# Altium schematic sheet CAN.SchDoc
size A4; SheetNumber: 3; SheetTotal: 7
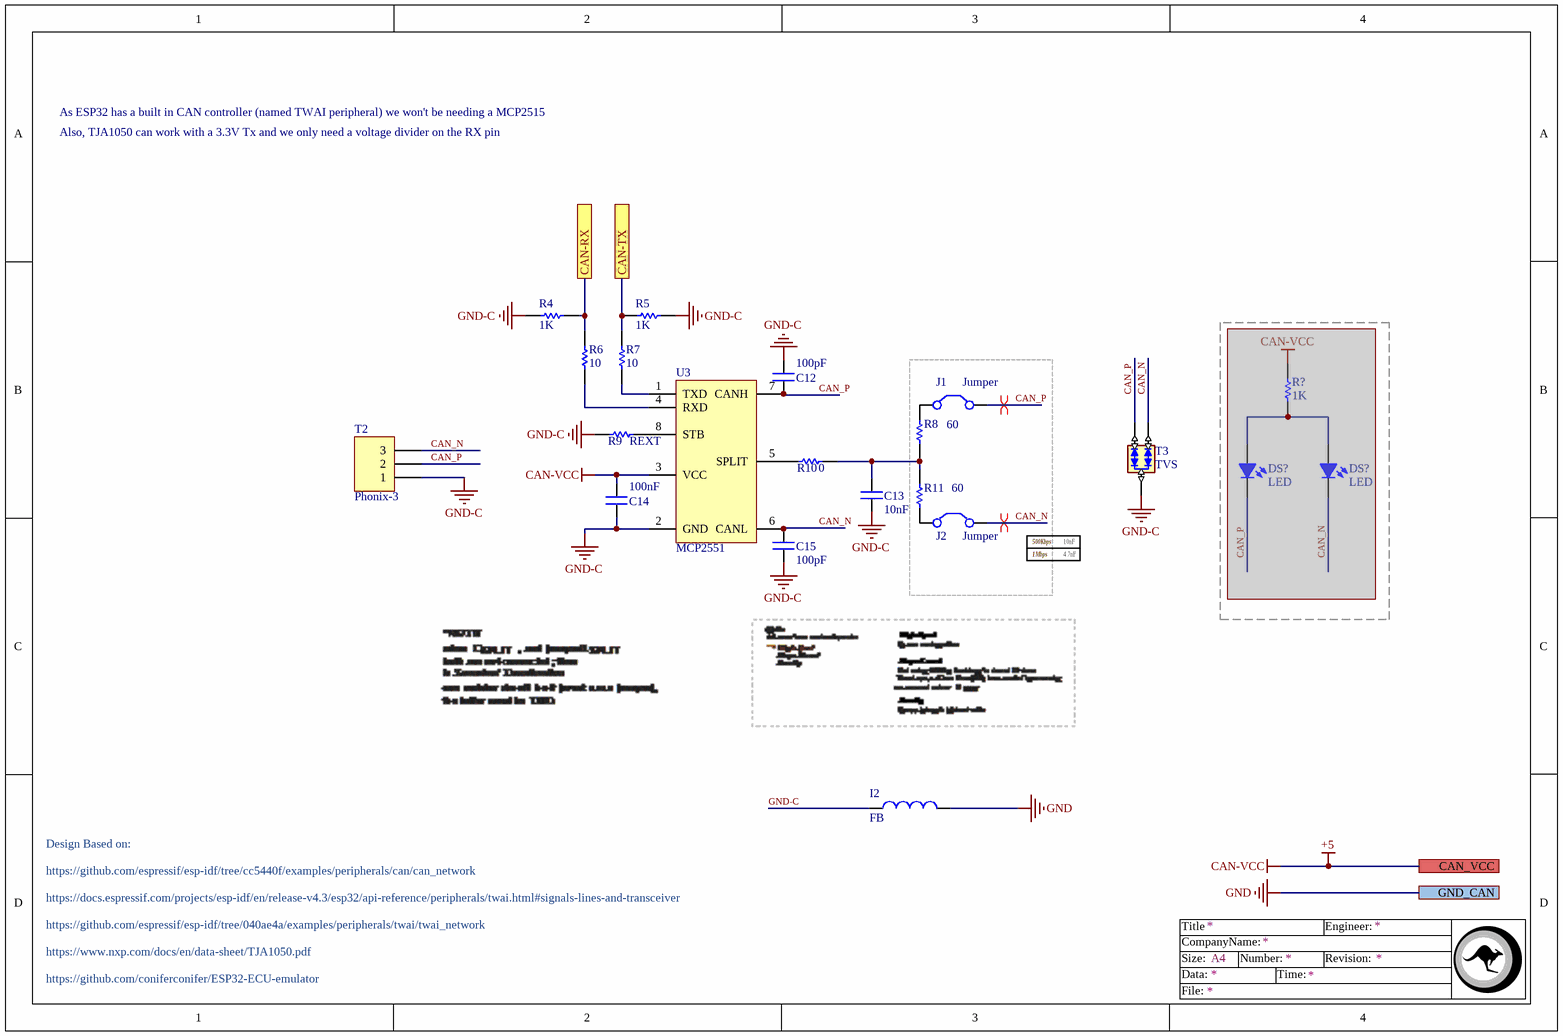
[diagram p0: CAN.SchDoc]

## Parts
(Parts that share a designator on the sheet are numbered #1, #2 ... from top to bottom, then left to right.)
C12  100pF  [Cap0805]
C13  10nF  [Cap0805]
C14  100nF  [Cap0805]
C15  100pF  [Cap0805]
DS?#1  LED  [LED_0805Green]  (masked out: inside a compile mask, not in the netlist)
DS?#2  LED  [LED_0805Green]  (masked out: inside a compile mask, not in the netlist)
I2  FB  [1206]
J1  Jumper  [Jumper Small - 2.54 - Blue]
J2  Jumper  [Jumper Small - 2.54 - Blue]
R4  1K  [R0805]
R5  1K  [R0805]
R6  10  [R0805]
R7  10  [R0805]
R8  60  [R0805]
R9  REXT  [R0805]
R10  0  [R0805]
R11  60  [R0805]
R?  1K  [R0805]  (masked out: inside a compile mask, not in the netlist)
T2  Phonix-3  [Phonix-3]
T3  TVS  [SOT23]
U3  MCP2551  [SO4]

## Ports
CAN-RX (see Dashboard - Multifunctional Probe[4C], Core-ESP32[3B]), CAN-TX (see Dashboard - Multifunctional Probe[4C], Core-ESP32[3A]), CAN_VCC (see Dashboard - Multifunctional Probe[4C]), GND_CAN (see Dashboard - Multifunctional Probe[4C])

## Nets
+5: C14.1 U3.3(VCC) ; port CAN_VCC  [also labelled CAN-VCC]
GND: I2.2 ; port GND_CAN
GND-C: C12.1 C13.1 C14.2 C15.1 I2.1 R4.2 R5.1 R9.2 T2.1 T3.1(GND) U3.2(GND)
CAN-RX: R4.1 R6.2 ; port CAN-RX
CAN-TX: R5.2 R7.2 ; port CAN-TX
CAN_N: C15.2 J2.2(C2) T2.3 T3.2(CANH) U3.6(CANL)
CAN_P: C12.2 J1.2(C2) T2.2 T3.3(CANL) U3.7(CANH)
NetC13_2: C13.2 R8.2 R10.1 R11.2
NetJ1_1: J1.1(C1) R8.1
NetJ2_1: J2.1(C1) R11.1
NetR6_1: R6.1 U3.4(RXD)
NetR7_1: R7.1 U3.1(TXD)
NetR9_1: R9.1 U3.8(STB)
NetR10_2: R10.2 U3.5(SPLIT)

## Layout directives
differential pair: CAN_N, CAN_P

## Notes on the sheet
- As ESP32 has a built in CAN controller (named TWAI peripheral) we won't be needing a MCP2515
- Also, TJA1050 can work with a 3.3V Tx and we only need a voltage divider on the RX pin
- Design Based on:
  https://github.com/espressif/esp-idf/tree/cc5440f/examples/peripherals/can/can_network
  https://docs.espressif.com/projects/esp-idf/en/release-v4.3/esp32/api-reference/peripherals/twai.html#signals-lines-and-transceiver
  https://github.com/espressif/esp-idf/tree/040ae4a/examples/peripherals/twai/twai_network
  https://www.nxp.com/docs/en/data-sheet/TJA1050.pdf
  https://github.com/coniferconifer/ESP32-ECU-emulator
- Title
- Size:
- Data:
- CompanyName:
- A4
- Number:
- Time:
- Revision:
- Engineer:
- File:

## Library data of the parts
C12-C15 = Cap: Surface mount Capacitor
I2 = Inductor: Indicator
R4-R11 R? = Resistor
T2 = Phonix-3: Connector
T3 = ESD
U3 = MCP2551: CAN IC